# EAGLE design emilyBoard (EAGLE 7.5.0)
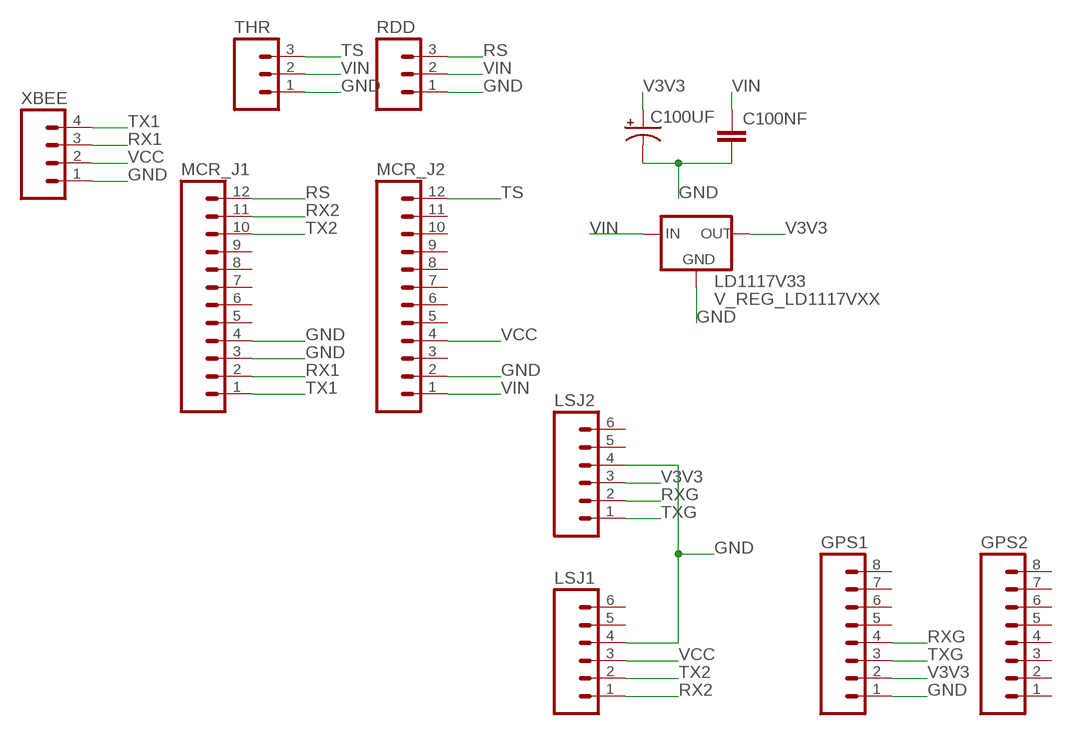
[diagram p0: schematic, sheet 1]

## Parts
C100NF  CAPEZ  [CAP-PTH-SMALLEZ]
C100UF  CAP_POLPTH1  [CPOL-RADIAL-100UF-25V]
GPS1  M08  [1X08_ROUND]
GPS2  M08  [1X08_ROUND]
LD1117V33  V_REG_LD1117VXX  [78XXL]
LSJ1  M06NO_SILK_FEMALE_PTH  [1X06_NO_SILK]
LSJ2  M06NO_SILK_FEMALE_PTH  [1X06_NO_SILK]
MCR_J1  M12PTH  [1X12]
MCR_J2  M12PTH  [1X12]
RDD  M03PTH  [1X03]
THR  M03PTH  [1X03]
XBEE  M04PTH  [1X04]

## Nets
GND: C100NF.2 C100UF.2(-) GPS1.1 LD1117V33.IN(GND) LSJ1.4 LSJ2.4 MCR_J1.3 MCR_J1.4 MCR_J2.2 RDD.1 THR.1 XBEE.1
RS: MCR_J1.12 RDD.3
RX1: MCR_J1.2 XBEE.3
RX2: LSJ1.1 MCR_J1.11
RXG: GPS1.4 LSJ2.2
TS: MCR_J2.12 THR.3
TX1: MCR_J1.1 XBEE.4
TX2: LSJ1.2 MCR_J1.10
TXG: GPS1.3 LSJ2.1
V3V3: C100UF.1(+) GPS1.2 LD1117V33.GND(OUT) LSJ2.3
VCC: LSJ1.3 MCR_J2.4 XBEE.2
VIN: C100NF.1 LD1117V33.OUT(IN) MCR_J2.1 RDD.2 THR.2
Unconnected: GPS1.5 GPS1.6 GPS1.7 GPS1.8 GPS2.1 GPS2.2 GPS2.3 GPS2.4 GPS2.5 GPS2.6 GPS2.7 GPS2.8 LSJ1.5 LSJ1.6 LSJ2.5 LSJ2.6 MCR_J1.5 MCR_J1.6 MCR_J1.7 MCR_J1.8 MCR_J1.9 MCR_J2.3 MCR_J2.5 MCR_J2.6 MCR_J2.7 MCR_J2.8 MCR_J2.9 MCR_J2.10 MCR_J2.11

## Library data of the parts
C100NF = SparkFun-Capacitors:CAP: Capacitor Standard 0603 ceramic capacitor, and 0.1" leaded capacitor.
C100UF = SparkFun-Capacitors:CAP_POL: Capacitor Polarized These are standard SMD and PTH capacitors. Normally 10uF, 47uF, and 100uF in electrolytic and tantalum varieties. Always verify the external diameter of the through hole cap, it varies with capacity, voltage, and manufacturer. The EIA devices should be standard.
GPS1 GPS2 = SparkFun-Connectors:M08: Header 8 Standard 8-pin 0.1" header. Use with straight break away headers (SKU : PRT-00116), right angle break away headers (PRT-00553), swiss pins (PRT-00743), machine pins (PRT-00117), and female headers (PRT-00115).; PROD_ID: CONN-08437
LD1117V33 = SparkFun-PowerIC:V_REG_LD1117VXX: LD1117VXX voltage regulator. We carry the 3.3V version (COM-00526) in TO-220 package.
LSJ1 LSJ2 = SparkFun-Connectors:M06: Header 6 Standard 6-pin 0.1" header. Use with straight break away headers (SKU : PRT-00116), right angle break away headers (PRT-00553), swiss pins (PRT-00743), machine pins (PRT-00117), and female headers (PRT-00115). Molex polarized connector foot print use with SKU : PRT-08094 with associated crimp pins and housings. NOTES ON THE VARIANTS LOCK and LOCK_LONGPADS... This footprint was designed to help hold the alignment of a through-hole component (i.e. 6-pin header) while soldering it into place. You may notice that each hole has been shifted either up or down by 0.005 of an inch from it's more standard position (which is a perfectly straight line). This slight alteration caused the pins (the squares in the middle) to touch the edges of the holes. Because they are alternating, it causes a "brace" to hold the component in place. 0.005 has proven to be the perfect amount of "off-center" position when using our standard breakaway headers. Although looks a little odd when you look at the bare footprint, once you have a header in there, the alteration is very hard to notice. Also,if you push a header all the way into place, it is covered up entirely on the bottom side. This idea of altering the position of holes to aid alignment will be further integrated into the Sparkfun Library for other footprints. It can help hold any component with 3 or more connection pins.; PROD_ID: CONN-08437
MCR_J1 MCR_J2 = SparkFun-Connectors:M12: Header 12 Standard 12-pin 0.1" header. Use with straight break away headers (SKU : PRT-00116), right angle break away headers (PRT-00553), swiss pins (PRT-00743), machine pins (PRT-00117), and female headers (PRT-00115).
RDD THR = SparkFun-Connectors:M03: Header 3 Standard 3-pin 0.1" header. Use with straight break away headers (SKU : PRT-00116), right angle break away headers (PRT-00553), swiss pins (PRT-00743), machine pins (PRT-00117), and female headers (PRT-00115). Molex polarized connector foot print use with SKU : PRT-08232 with associated crimp pins and housings.
XBEE = SparkFun-Connectors:M04: Header 4 Standard 4-pin 0.1" header. Use with straight break away headers (SKU : PRT-00116), right angle break away headers (PRT-00553), swiss pins (PRT-00743), machine pins (PRT-00117), and female headers (PRT-00115). Molex polarized connector foot print use with SKU : PRT-08231 with associated crimp pins and housings. 1MM SMD Version SKU: PRT-10208; PROD_ID: CONN-09696

## Board
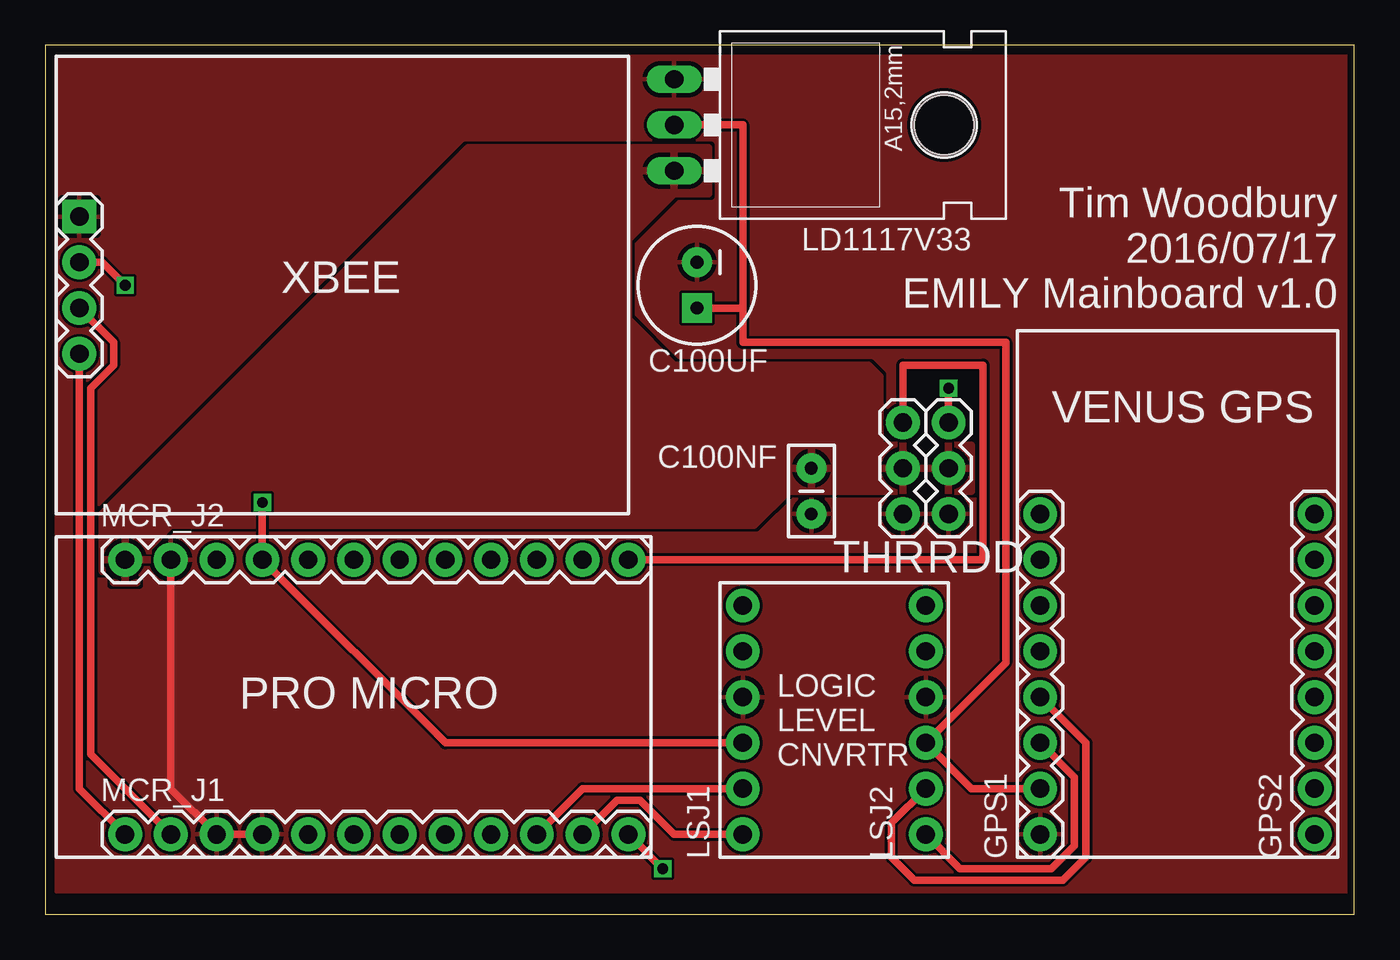
[diagram p1: board, top side]
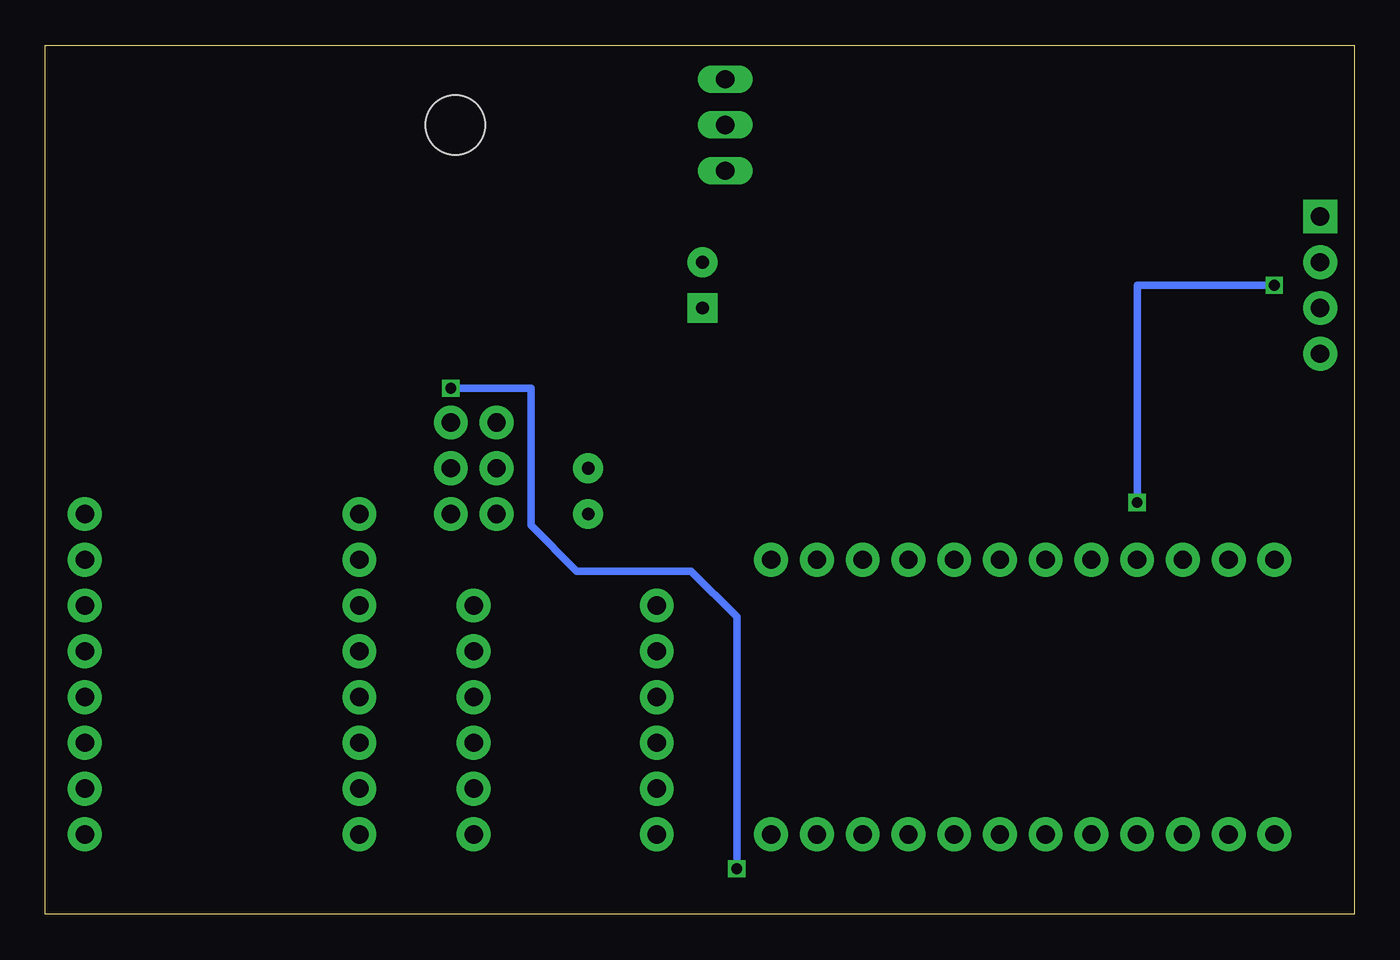
[diagram p2: board, bottom side, seen from below]

Size 72.69 x 48.25 mm. Coordinates in mm from the lower left corner, seen from the top.
Outline: 0,0 72.69,0 72.69,48.25 0,48.25 0,0
Copper layers (1*16): Top 0.0356mm / dielectric 1.5011mm / Bottom 0.0356mm
Design rules "LaenPCBOrder": minimum track width 6mil, minimum drill 13mil, track to track 6mil, track to pad 6mil, pad to pad 6mil, via to via 6mil, smd to smd 6mil, copper to edge 15mil, drill to drill 6mil, minimum pad ring 7mil, minimum via ring 7mil, stop-mask expansion 3mil, vias tented up to drill 0mil, thermal gap 10mil

### Footprints (pad centres in the part's own frame; a part is rotated, then mirrored left to right if it is on the bottom)
CAP-PTH-SMALLEZ = drill 0.7 pad 1.651: 1 0,0; 2 2.54,0
CPOL-RADIAL-100UF-25V = drill 0.7 pad 1.651 square: 1 1.27,0 | drill 0.7 pad 1.651: 2 -1.27,0
1X08_ROUND = drill 1.016 pad 1.88: 1 0,0; 2 2.54,0; 3 5.08,0; 4 7.62,0; 5 10.16,0; 6 12.7,0; 7 15.24,0; 8 17.78,0
78XXL = drill 1.016 long: GND 0,-3.81; IN -2.54,-3.81; OUT 2.54,-3.81 | hole 3.302: 0,11.176
1X06_NO_SILK = drill 1.016 pad 1.88: 1 0,0; 2 2.54,0; 3 5.08,0; 4 7.62,0; 5 10.16,0; 6 12.7,0
1X12 = drill 1.016 pad 1.88: 1 0,0; 2 2.54,0; 3 5.08,0; 4 7.62,0; 5 10.16,0; 6 12.7,0; 7 15.24,0; 8 17.78,0; 9 20.32,0; 10 22.86,0; 11 25.4,0; 12 27.94,0
1X03 = drill 1.016 pad 1.88: 1 0,0; 2 2.54,0; 3 5.08,0
1X04 = drill 1.016 pad 1.88 square: 1 0,0 | drill 1.016 pad 1.88: 2 2.54,0; 3 5.08,0; 4 7.62,0

### Placement (x,y rotation side)
C100NF  42.55,24.76 270 top
C100UF  36.2,34.93 270 top
GPS1  55.25,4.45 90 top
GPS2  70.48,4.45 90 top
LD1117V33  38.73,43.82 270 top
LSJ1  38.73,4.45 90 top
LSJ2  48.89,4.45 90 top
MCR_J1  4.45,4.45 0 top
MCR_J2  4.45,19.68 0 top
RDD  50.16,22.22 90 top
THR  47.62,22.22 90 top
XBEE  1.91,38.73 270 top

### Tracks (layer width: path | path; a pad name or v marks a point on that pad's centre or on a via)
GND
  Top 0.406: MCR_J2.2 6.99,6.99 MCR_J1.3 MCR_J1.4
  pour Top (rank 6): 0.64,47.62 0.64,1.27 72.39,1.27 72.39,47.62
RS  (via drill 0.6)
  Top 0.406: MCR_J1.12 v34.29,2.54 | v50.16,29.21 RDD.3
  Bottom 0.406: v50.16,29.21 45.72,29.21 45.72,21.59 43.18,19.05 36.83,19.05 34.29,16.51 v34.29,2.54
RX1
  Top 0.406: XBEE.3 3.81,31.75 3.81,30.48 2.54,29.21 2.54,8.89 MCR_J1.2
RX2
  Top 0.406: MCR_J1.11 31.75,6.35 33.02,6.35 34.92,4.45 LSJ1.1
RXG
  Top 0.406: GPS1.4 57.78,9.53 57.78,3.17 56.52,1.91 48.26,1.91 46.99,3.17 46.99,5.08 LSJ2.2
TS
  Top 0.406: THR.3 47.62,30.48 52.07,30.48 52.07,19.68 MCR_J2.12
TX1
  Top 0.406: XBEE.4 1.91,6.99 MCR_J1.1
TX2
  Top 0.406: MCR_J1.10 29.85,6.99 LSJ1.2
TXG
  Top 0.406: GPS1.3 57.15,7.62 57.15,3.81 55.88,2.54 50.8,2.54 LSJ2.1
V3V3
  Top 0.406: LD1117V33.GND 38.73,43.82 38.73,33.66 | 38.73,33.66 38.73,31.75 53.34,31.75 53.34,13.97 LSJ2.3 51.44,6.99 GPS1.2 | 38.73,33.66 C100UF.1
VCC  (via drill 0.6)
  Top 0.406: LSJ1.3 22.22,9.53 MCR_J2.4 v12.07,22.86 | XBEE.2 3.18,36.2 v4.45,34.93
  Bottom 0.406: v4.45,34.93 12.07,34.93 v12.07,22.86
VIN
  pour Top: 46.36,26.04 51.44,26.04 51.44,23.49 41.28,23.49 39.37,21.59 6.99,21.59 5.71,20.32 5.71,19.05 5.08,18.41 3.81,18.41 3.18,19.05 3.18,22.22 23.5,42.55 36.83,42.55 36.83,40.01 34.92,40.01 32.39,37.47 32.39,33.02 34.92,30.48 45.72,30.48 46.36,29.84

### Text on the board
tPlace: VENUS GPS | LOGIC / LEVEL / CNVRTR
tNames: Tim Woodbury / 2016/07/17 / EMILY Mainboard v1.0 | PRO MICRO